# EAGLE schematic MTP_worp1 (EAGLE 7.5.0)
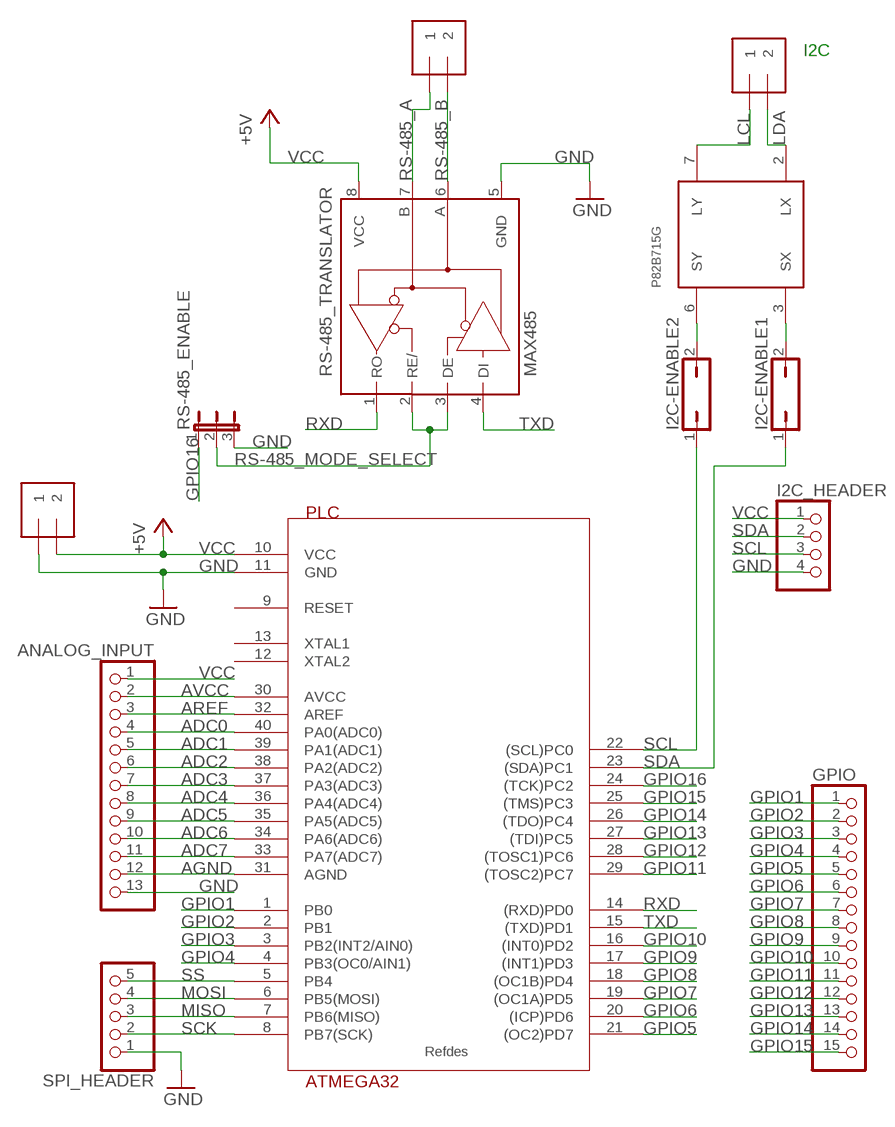
[diagram p0: schematic, sheet 1]

## Parts
ANALOG_INPUT  PINHD-1X13  [1X13]
GPIO  PINHD-1X15-CB  [1X15-CB]
I2C  1X2-3.5MM  [1X2-3.5MM]
I2C-ENABLE1  JP1Q  [JP1]
I2C-ENABLE2  JP1Q  [JP1]
I2C_HEADER  PINHD-1X4  [1X04]
P82B715  82B715TD  [SO8]
PLC  ATMEGA32  ATMEGA32-PU  [DIP254P1524X482-40]
POWER  1X2-3.5MM  [1X2-3.5MM]
RS-485  1X2-3.5MM  [1X2-3.5MM]
RS-485_ENABLE  JP2E  [JP2]
RS-485_TRANSLATOR  MAX485  MAX3468CPA  [DIL08]
SPI_HEADER  PINHD-1X5  [1X05]

## Nets
ADC0: ANALOG_INPUT.4 PLC.40(PA0(ADC0))
ADC1: ANALOG_INPUT.5 PLC.39(PA1(ADC1))
ADC2: ANALOG_INPUT.6 PLC.38(PA2(ADC2))
ADC3: ANALOG_INPUT.7 PLC.37(PA3(ADC3))
ADC4: ANALOG_INPUT.8 PLC.36(PA4(ADC4))
ADC5: ANALOG_INPUT.9 PLC.35(PA5(ADC5))
ADC6: ANALOG_INPUT.10 PLC.34(PA6(ADC6))
ADC7: ANALOG_INPUT.11 PLC.33(PA7(ADC7))
AGND: ANALOG_INPUT.12 PLC.31(AGND)
AREF: ANALOG_INPUT.3 PLC.32(AREF)
AVCC: ANALOG_INPUT.2 PLC.30(AVCC)
GND: ANALOG_INPUT.13 I2C_HEADER.4 PLC.11(GND) POWER.1 RS-485_ENABLE.3 RS-485_TRANSLATOR.5(GND) SPI_HEADER.1
GPIO1: GPIO.1 PLC.1(PB0)
GPIO2: GPIO.2 PLC.2(PB1)
GPIO3: GPIO.3 PLC.3(PB2(INT2/AIN0))
GPIO4: GPIO.4 PLC.4(PB3(OC0/AIN1))
GPIO5: GPIO.5 PLC.21((OC2)PD7)
GPIO6: GPIO.6 PLC.20((ICP)PD6)
GPIO7: GPIO.7 PLC.19((OC1A)PD5)
GPIO8: GPIO.8 PLC.18((OC1B)PD4)
GPIO9: GPIO.9 PLC.17((INT1)PD3)
GPIO10: GPIO.10 PLC.16((INT0)PD2)
GPIO11: GPIO.11 PLC.29((TOSC2)PC7)
GPIO12: GPIO.12 PLC.28((TOSC1)PC6)
GPIO13: GPIO.13 PLC.27((TDI)PC5)
GPIO14: GPIO.14 PLC.26((TDO)PC4)
GPIO15: GPIO.15 PLC.25((TMS)PC3)
GPIO16: PLC.24((TCK)PC2) RS-485_ENABLE.1
LCL: I2C.1 P82B715.7(G:LY)
LDA: I2C.2 P82B715.2(G:LX)
MISO: PLC.7(PB6(MISO)) SPI_HEADER.3
MOSI: PLC.6(PB5(MOSI)) SPI_HEADER.4
N$1: I2C-ENABLE2.2 P82B715.6(G:SY)
N$13: I2C-ENABLE1.2 P82B715.3(G:SX)
RS-485_A: RS-485.1 RS-485_TRANSLATOR.7(B)
RS-485_B: RS-485.2 RS-485_TRANSLATOR.6(A)
RS-485_MODE_SELECT: RS-485_ENABLE.2 RS-485_TRANSLATOR.2(RE/) RS-485_TRANSLATOR.3(DE)
RXD: PLC.14((RXD)PD0) RS-485_TRANSLATOR.1(RO)
SCK: PLC.8(PB7(SCK)) SPI_HEADER.2
SCL: I2C-ENABLE2.1 I2C_HEADER.3 PLC.22((SCL)PC0)
SDA: I2C-ENABLE1.1 I2C_HEADER.2 PLC.23((SDA)PC1)
SS: PLC.5(PB4) SPI_HEADER.5
TXD: PLC.15((TXD)PD1) RS-485_TRANSLATOR.4(DI)
VCC: ANALOG_INPUT.1 I2C_HEADER.1 PLC.10(VCC) POWER.2 RS-485_TRANSLATOR.8(VCC) ; supply symbol labelled +5V
Unconnected: P82B715.1(NC:NC) P82B715.5(NC:NC) PLC.9(RESET) PLC.12(XTAL2) PLC.13(XTAL1)

## Notes on the sheet
- I2C

## Power pins joined to a net without a drawn wire
GND: P82B715.4(P:GND)
VCC: P82B715.8(P:VCC)

## Library data of the parts
ANALOG_INPUT = pinhead:PINHD-1X13: PIN HEADER
GPIO = adafruit:PINHD-1X15: PIN HEADER
I2C POWER RS-485 = adafruit:1X2: 3.5mm Terminal block http://www.ladyada.net/library/pcb/eaglelibrary.html
I2C-ENABLE1 I2C-ENABLE2 = jumper:JP1Q: JUMPER
I2C_HEADER = pinhead:PINHD-1X4: PIN HEADER
P82B715 = micro-philips:82B715: I2C bus extender; MPN: P82B715TD,118; OC_FARNELL: 1627047; OC_NEWARK: 70R8457
PLC = ArpanMTP1:ATMEGA32-PU: ATMEGA32-DIP-Variant
RS-485_ENABLE = jumper:JP2E: JUMPER
RS-485_TRANSLATOR = maxim:MAX34*: +5V, Fail-Safe, 40Mbps, Profibus RS-485/RS-422 Transceivers Source: MAX3465-MAX3469.pdf; OC_FARNELL: unknown; OC_NEWARK: unknown
SPI_HEADER = pinhead:PINHD-1X5: PIN HEADER